# EAGLE schematic balvin (EAGLE 9.6.2)
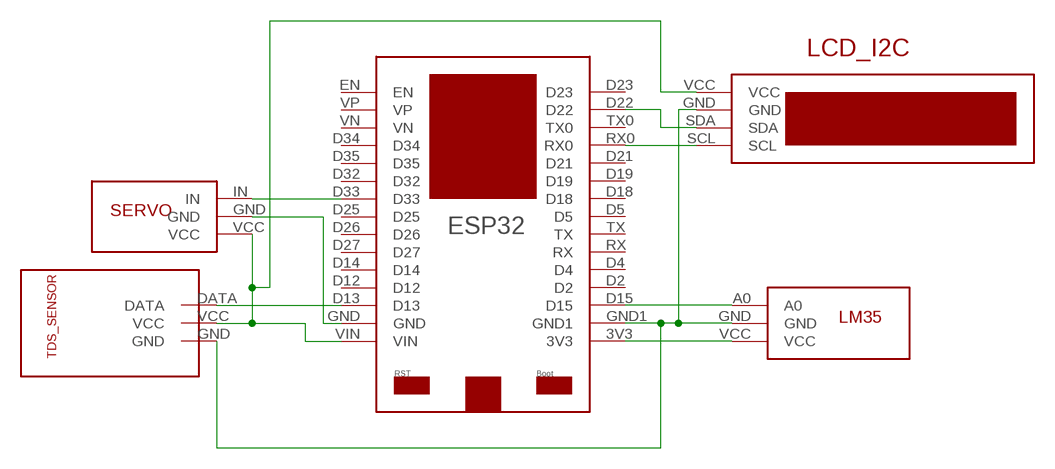
[diagram p0: schematic, sheet 1]

## Parts
U$1  ESP32  [ESP32]
U$2  TDS_SENSOR  [TDS_SENSOR]
U$3  LM35_SENSOR  [LM35_SENSOR]
U$4  SERVO_MOTOR  [SERVO_MOTOR]
U$5  LCD_I2C  [LCD_I2C]

## Nets
N$1: U$1.GND1 U$2.GND U$3.GND U$5.GND
N$2: U$1.VIN U$2.VCC U$4.VCC U$5.VCC
N$3: U$1.D13 U$2.DATA
N$4: U$1.3V3 U$3.VCC
N$5: U$1.D15 U$3.A0
N$6: U$1.GND U$4.GND
N$7: U$1.D33 U$4.IN
N$8: U$1.D22 U$5.SDA
N$9: U$1.RX0 U$5.SCL
Unconnected: U$1.D2 U$1.D4 U$1.D5 U$1.D12 U$1.D14 U$1.D18 U$1.D19 U$1.D21 U$1.D23 U$1.D25 U$1.D26 U$1.D27 U$1.D32 U$1.D34 U$1.D35 U$1.EN U$1.RX U$1.TX U$1.TX0 U$1.VN U$1.VP

## Library data of the parts
U$1 = Custom_evan:ESP32
U$2 = Custom_evan:TDS_SENSOR
U$3 = Custom_evan:LM35_SENSOR
U$4 = Custom_evan:SERVO_MOTOR
U$5 = Custom_evan:LCD_I2C